# EAGLE design PCB_teensy (EAGLE 9.0.0)
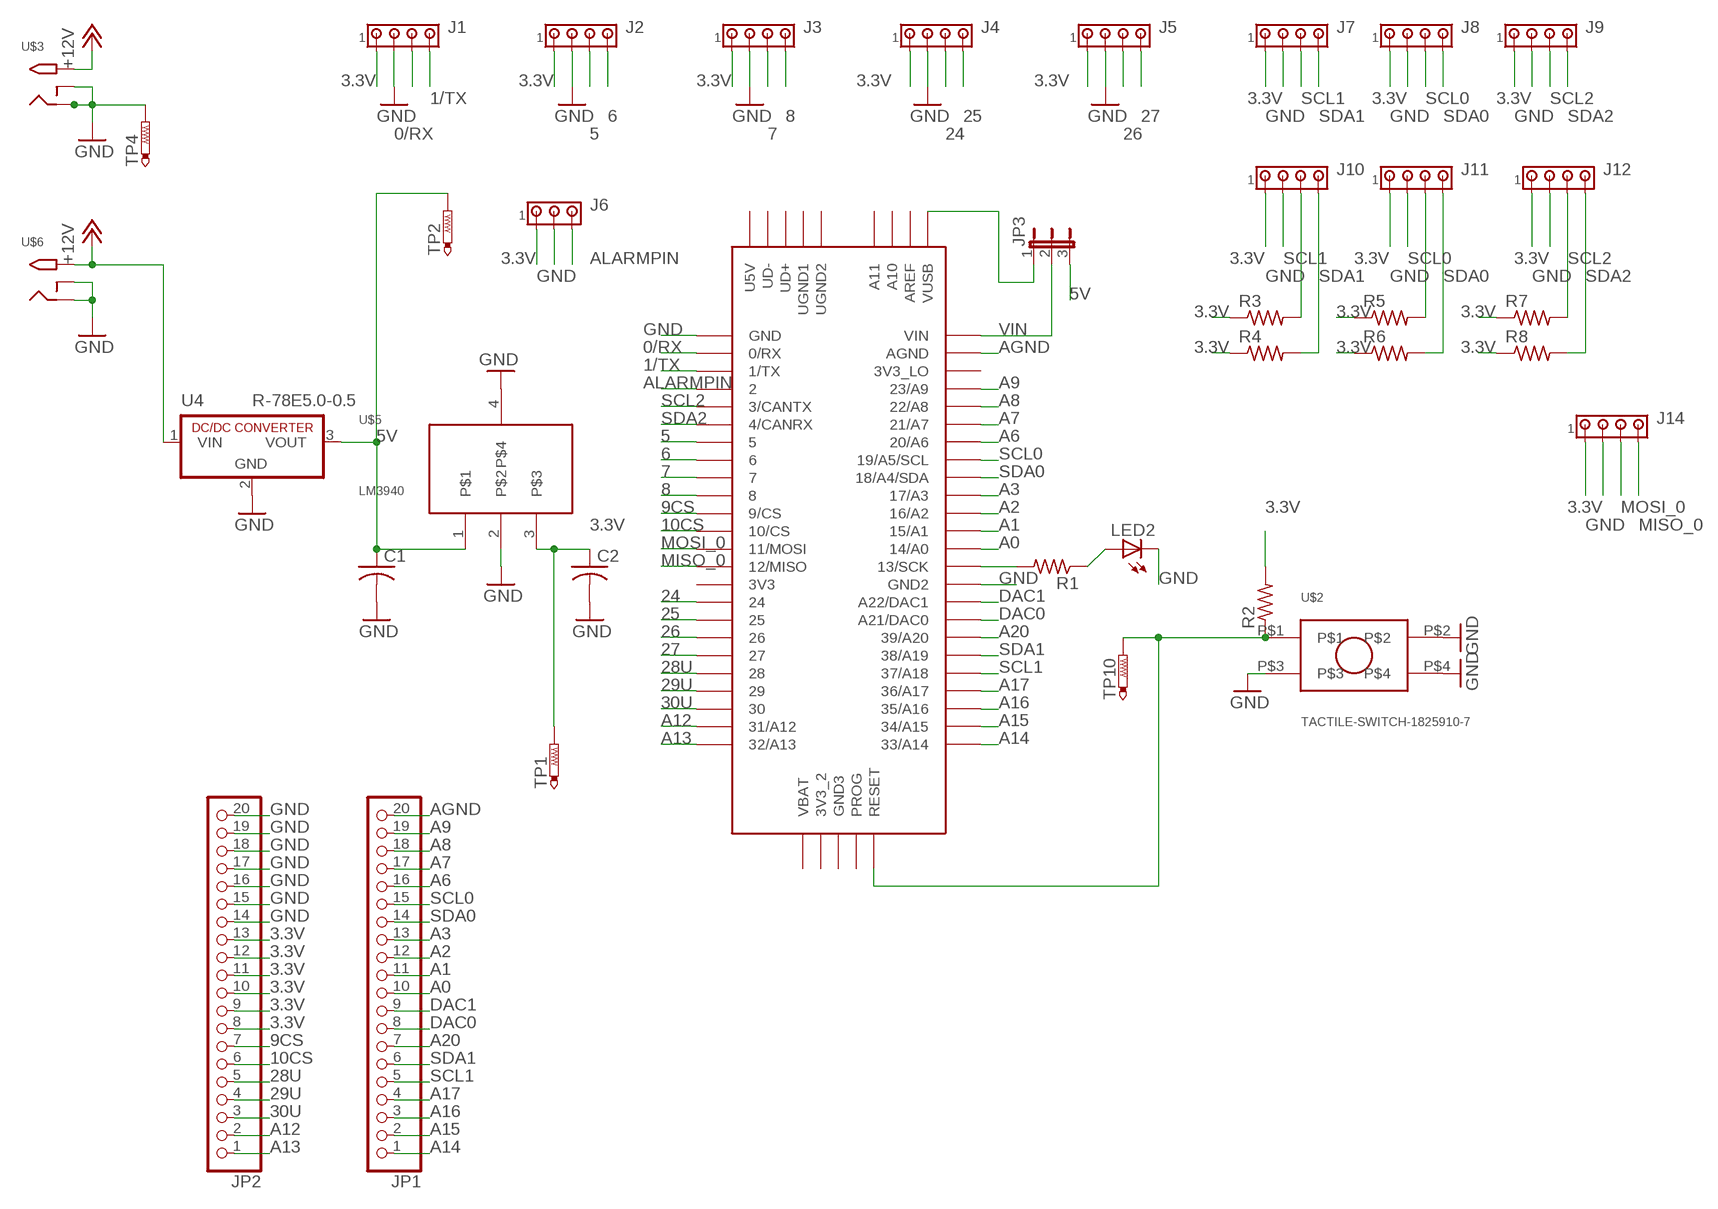
[diagram p0: schematic, sheet 1]

## Parts
C1  C-USC0805  [C0805]
C2  C-USC0805  [C0805]
J1  MTA04-100  [10X04MTA]
J2  MTA04-100  [10X04MTA]
J3  MTA04-100  [10X04MTA]
J4  MTA04-100  [10X04MTA]
J5  MTA04-100  [10X04MTA]
J6  MTA03-100  [10X03MTA]
J7  MTA04-100  [10X04MTA]
J8  MTA04-100  [10X04MTA]
J9  MTA04-100  [10X04MTA]
J10  MTA04-100  [10X04MTA]
J11  MTA04-100  [10X04MTA]
J12  MTA04-100  [10X04MTA]
J14  MTA04-100  [10X04MTA]
JP1  PINHD-1X20  [1X20]
JP2  PINHD-1X20  [1X20]
JP3  JP2W  [JP2W]
LED2  LEDCHIP-LED0805  [CHIP-LED0805]
R1  R-US_R0805  [R0805]
R2  R-US_R0805  [R0805]
R3  R-US_R0805  [R0805]
R4  R-US_R0805  [R0805]
R5  R-US_R0805  [R0805]
R6  R-US_R0805  [R0805]
R7  R-US_R0805  [R0805]
R8  R-US_R0805  [R0805]
TP1  PTR1B2,54  [B2,54]
TP2  PTR1B2,54  [B2,54]
TP4  PTR1B2,54  [B2,54]
TP10  PTR1B2,54  [B2,54]
U4  R-78E5.0-0.5  [SIP3]
U$1  TEENSY_3.5/3.6  [TEENSY_3.5/3.6]
U$2  TACTILE-SWITCH-1825910-7  [1825910-7]
U$3  2.1MMJACKTHM  [PJ-102A]
U$5  LM3940  [SOT223]
U$6  2.1MMJACKTHM  [PJ-102A]

## Nets
0/RX: J1.3 U$1.0/RX
1/TX: J1.4 U$1.1/TX
3.3V: C2.1 J1.1 J2.1 J3.1 J4.1 J5.1 J6.1 J7.1 J8.1 J9.1 J10.1 J11.1 J12.1 J14.1 JP2.8 JP2.9 JP2.10 JP2.11 JP2.12 JP2.13 R2.2 R3.1 R4.1 R5.1 R6.1 R7.1 R8.1 TP1.TP U$5.3
5: J2.3 U$1.5
5V: C1.1 JP3.3 TP2.TP U4.3(VOUT) U$5.1
6: J2.4 U$1.6
7: J3.3 U$1.7
8: J3.4 U$1.8
9CS: JP2.7 U$1.9/CS
10CS: JP2.6 U$1.10/CS
24: J4.3 U$1.24
25: J4.4 U$1.25
26: J5.3 U$1.26
27: J5.4 U$1.27
28U: JP2.5 U$1.28
29U: JP2.4 U$1.29
30U: JP2.3 U$1.30
+12V: U4.1(VIN) U$3.TIP U$6.TIP
A0: JP1.10 U$1.14/A0
A1: JP1.11 U$1.15/A1
A2: JP1.12 U$1.16/A2
A3: JP1.13 U$1.17/A3
A6: JP1.16 U$1.20/A6
A7: JP1.17 U$1.21/A7
A8: JP1.18 U$1.22/A8
A9: JP1.19 U$1.23/A9
A12: JP2.2 U$1.31/A12
A13: JP2.1 U$1.32/A13
A14: JP1.1 U$1.33/A14
A15: JP1.2 U$1.34/A15
A16: JP1.3 U$1.35/A16
A17: JP1.4 U$1.36/A17
A20: JP1.7 U$1.39/A20
AGND: JP1.20 U$1.AGND
ALARMPIN: J6.3 U$1.2
DAC0: JP1.8 U$1.21/DAC0(A21/DAC0)
DAC1: JP1.9 U$1.A22/DAC1
GND: C1.2 C2.2 J1.2 J2.2 J3.2 J4.2 J5.2 J6.2 J7.2 J8.2 J9.2 J10.2 J11.2 J12.2 J14.2 JP2.14 JP2.15 JP2.16 JP2.17 JP2.18 JP2.19 JP2.20 LED2.C TP4.TP U4.2(GND) U$1.GND U$1.GND2 U$2.P$2 U$2.P$3 U$2.P$4 U$3.RING U$3.RING_SW U$5.2 U$5.4 U$6.RING U$6.RING_SW
MISO_0: J14.4 U$1.12/MISO
MOSI_0: J14.3 U$1.11/MOSI
N$2: JP3.1 U$1.VUSB
N$4: R2.1 TP10.TP U$1.RESET U$2.P$1
N$17: R1.2 U$1.13/SCK
N$18: LED2.A R1.1
SCL0: J8.3 J11.3 JP1.15 R5.2 U$1.19/A5/SCL
SCL1: J7.3 J10.3 JP1.5 R3.2 U$1.37/A18
SCL2: J9.3 J12.3 R7.2 U$1.3/CANTX
SDA0: J8.4 J11.4 JP1.14 R6.2 U$1.18/A4/SDA
SDA1: J7.4 J10.4 JP1.6 R4.2 U$1.38/A19
SDA2: J9.4 J12.4 R8.2 U$1.4/CANRX
VIN: JP3.2 U$1.VIN
Unconnected: U$1.3V3 U$1.3V3_2 U$1.3V3_LO U$1.A10 U$1.A11 U$1.AREF U$1.GND3 U$1.PROG U$1.U5V U$1.UD+ U$1.UD- U$1.UGND1 U$1.UGND2 U$1.VBAT

## Library data of the parts
C1 C2 = adafruit:C-US: CAPACITOR, American symbol
J1-J5 J7-J12 J14 = con-amp:MTA04-100: AMP connector
J6 = con-amp:MTA03-100: AMP connector
JP1 JP2 = adafruit:PINHD-1X20: PIN HEADER
JP3 = jumper:JP2W: JUMPER
LED2 = led:LED: LED OSRAM: - CHIPLED LG R971, LG N971, LY N971, LG Q971, LY Q971, LO R971, LY R971 LH N974, LH R974 LS Q976, LO Q976, LY Q976 LO Q996 - Hyper CHIPLED LW Q18S LB Q993, LB Q99A, LB R99A - SideLED LS A670, LO A670, LY A670, LG A670, LP A670 LB A673, LV A673, LT A673, LW A673 LH A674 LY A675 LS A676, LA A676, LO A676, LY A676, LW A676 LS A679, LY A679, LG A679 - Hyper Micro SIDELED® LS Y876, LA Y876, LO Y876, LY Y876 LT Y87S - SmartLED LW L88C, LW L88S LB L89C, LB L89S, LG L890 LS L89K, LO L89K, LY L89K LS L896, LA L896, LO L896, LY L896 - TOPLED LS T670, LO T670, LY T670, LG T670, LP T670 LSG T670, LSP T670, LSY T670, LOP T670, LYG T670 LG T671, LOG T671, LSG T671 LB T673, LV T673, LT T673, LW T673 LH T674 LS T676, LA T676, LO T676, LY T676, LB T676, LH T676, LSB T676, LW T676 LB T67C, LV T67C, LT T67C, LS T67K, LO T67K, LY T67K, LW E67C LS E67B, LA E67B, LO E67B, LY E67B, LB E67C, LV E67C, LT E67C LW T67C LS T679, LY T679, LG T679 LS T770, LO T770, LY T770, LG T770, LP T770 LB T773, LV T773, LT T773, LW T773 LH T774 LS E675, LA E675, LY E675, LS T675 LS T776, LA T776, LO T776, LY T776, LB T776 LHGB T686 LT T68C, LB T68C - Hyper Mini TOPLED® LB M676 - Mini TOPLED Santana® LG M470 LS M47K, LO M47K, LY M47K Source: http://www.osram.convergy.de LUXEON: - LUMILED® LXK2-PW12-R00, LXK2-PW12-S00, LXK2-PW14-U00, LXK2-PW14-V00 LXK2-PM12-R00, LXK2-PM12-S00, LXK2-PM14-U00 LXK2-PE12-Q00, LXK2-PE12-R00, LXK2-PE12-S00, LXK2-PE14-T00, LXK2-PE14-U00 LXK2-PB12-K00, LXK2-PB12-L00, LXK2-PB12-M00, LXK2-PB14-N00, LXK2-PB14-P00, LXK2-PB14-Q00 LXK2-PR12-L00, LXK2-PR12-M00, LXK2-PR14-Q00, LXK2-PR14-R00 LXK2-PD12-Q00, LXK2-PD12-R00, LXK2-PD12-S00 LXK2-PH12-R00, LXK2-PH12-S00 LXK2-PL12-P00, LXK2-PL12-Q00, LXK2-PL12-R00 Source: www.luxeon.com KINGBRIGHT: KA-3528ASYC Source: www.kingbright.com
R1-R8 = adafruit:R-US_: RESISTOR, American symbol
TP1 TP2 TP4 TP10 = testpad:PTR1: TEST PIN
U4 = WALL-E_Parts:R-78E5.0-0.5
U$1 = WALL-E_Parts:TEENSY_3.5/3.6
U$2 = WALL-E_Parts:TACTILE-SWITCH-1825910-7
U$3 U$6 = adafruit:2.1MMJACK: 2.1mm x 5.5mm THM DC jack with internal switch. Digikey part #PJ-102A, 4UCON part #05537 2.1mm x 5.5mm SMT DC jack with internal switch. Digikey part #PJ-002A-SMT, 4UCON part #03267 By microbuilder.eu & adafruit.com
U$5 = WALL-E_Parts:LM3940

## Board
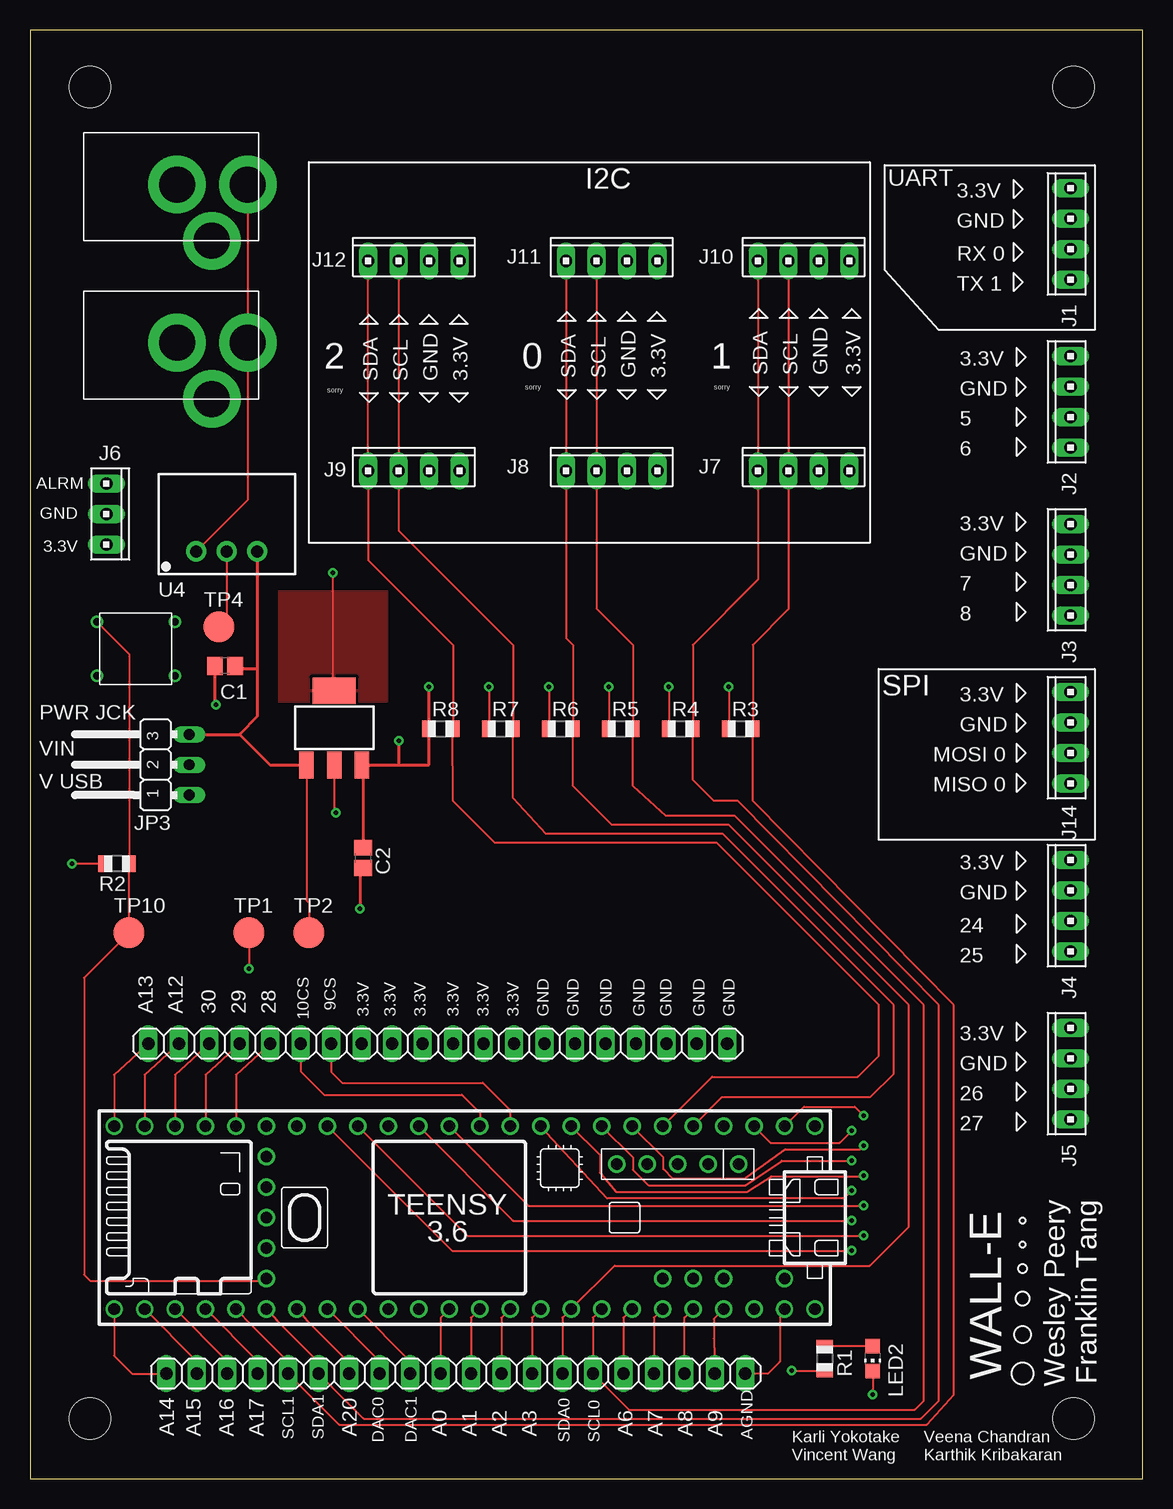
[diagram p1: board, top side]
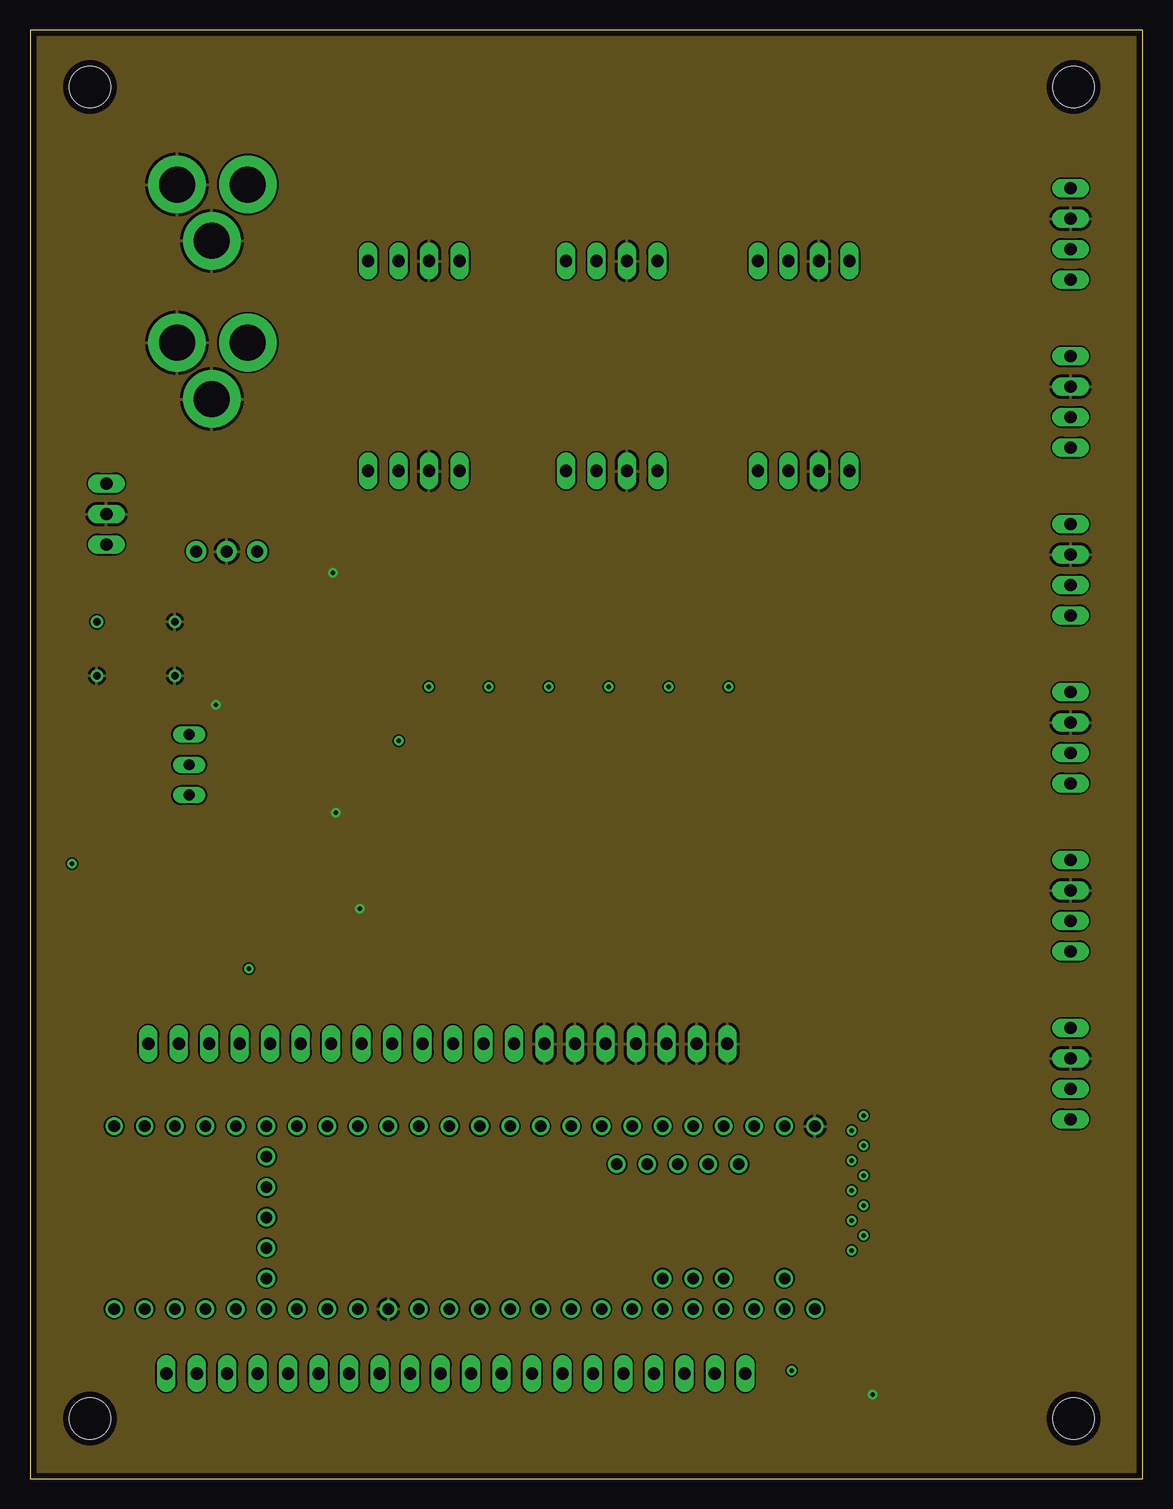
[diagram p2: board, inner layer Route2]
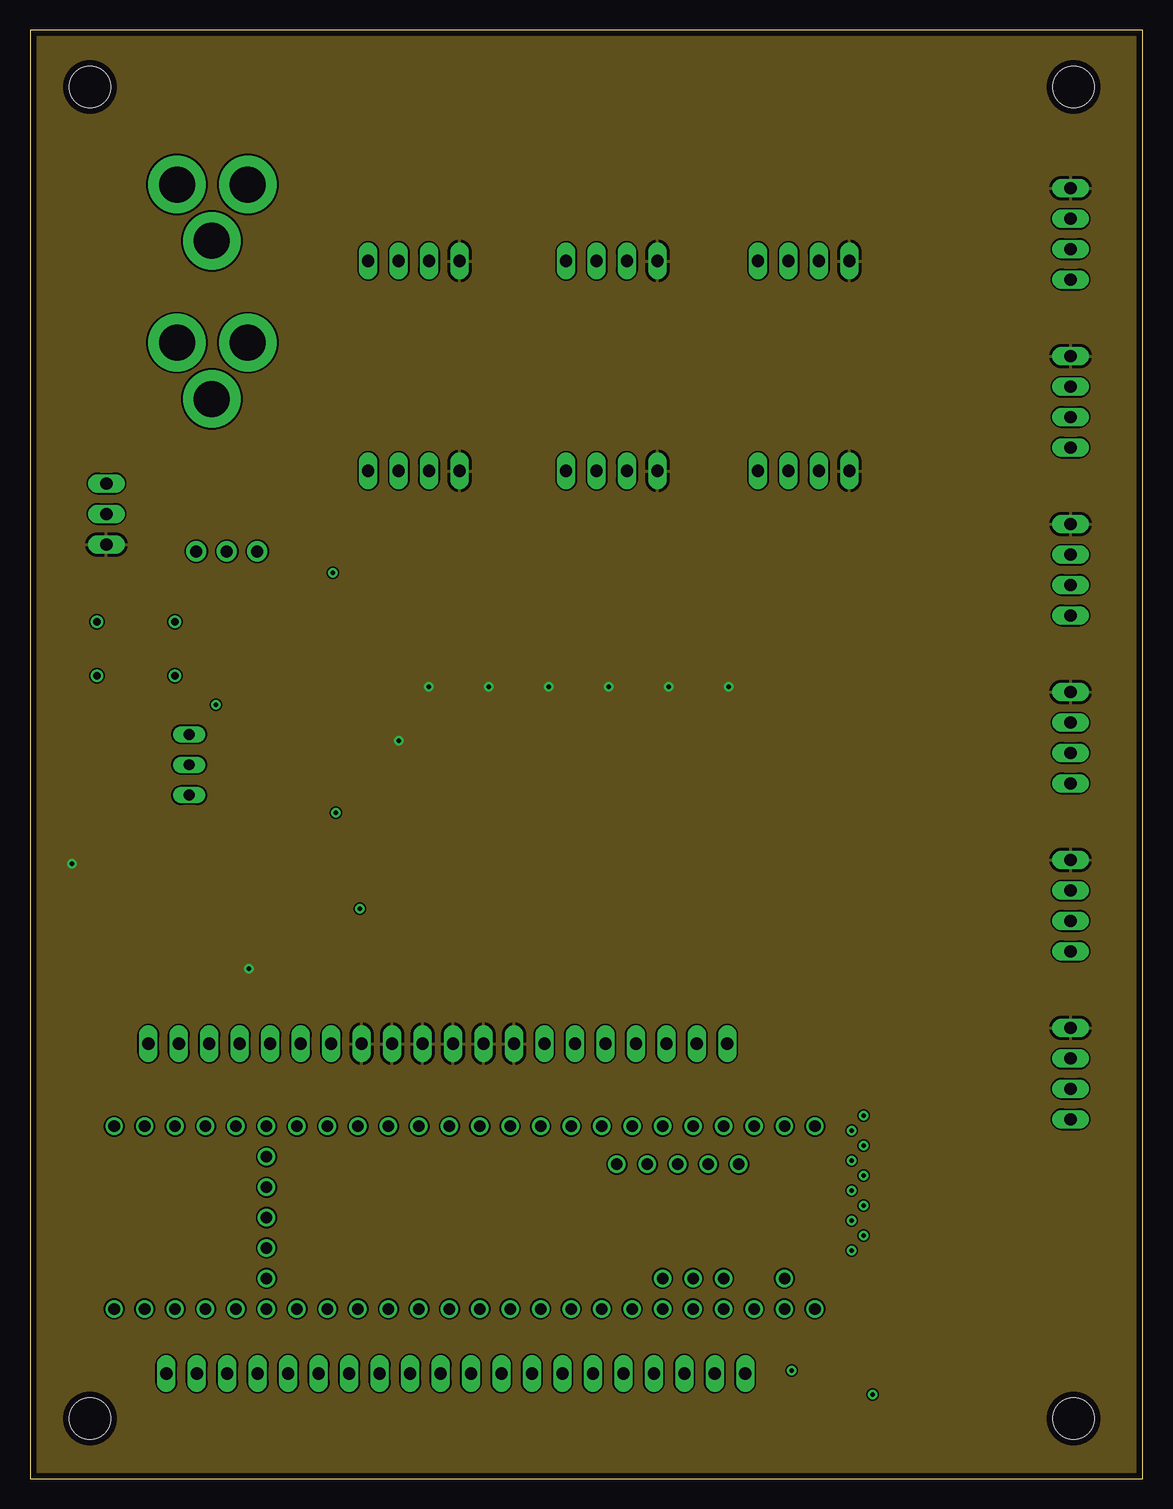
[diagram p3: board, inner layer Route15]
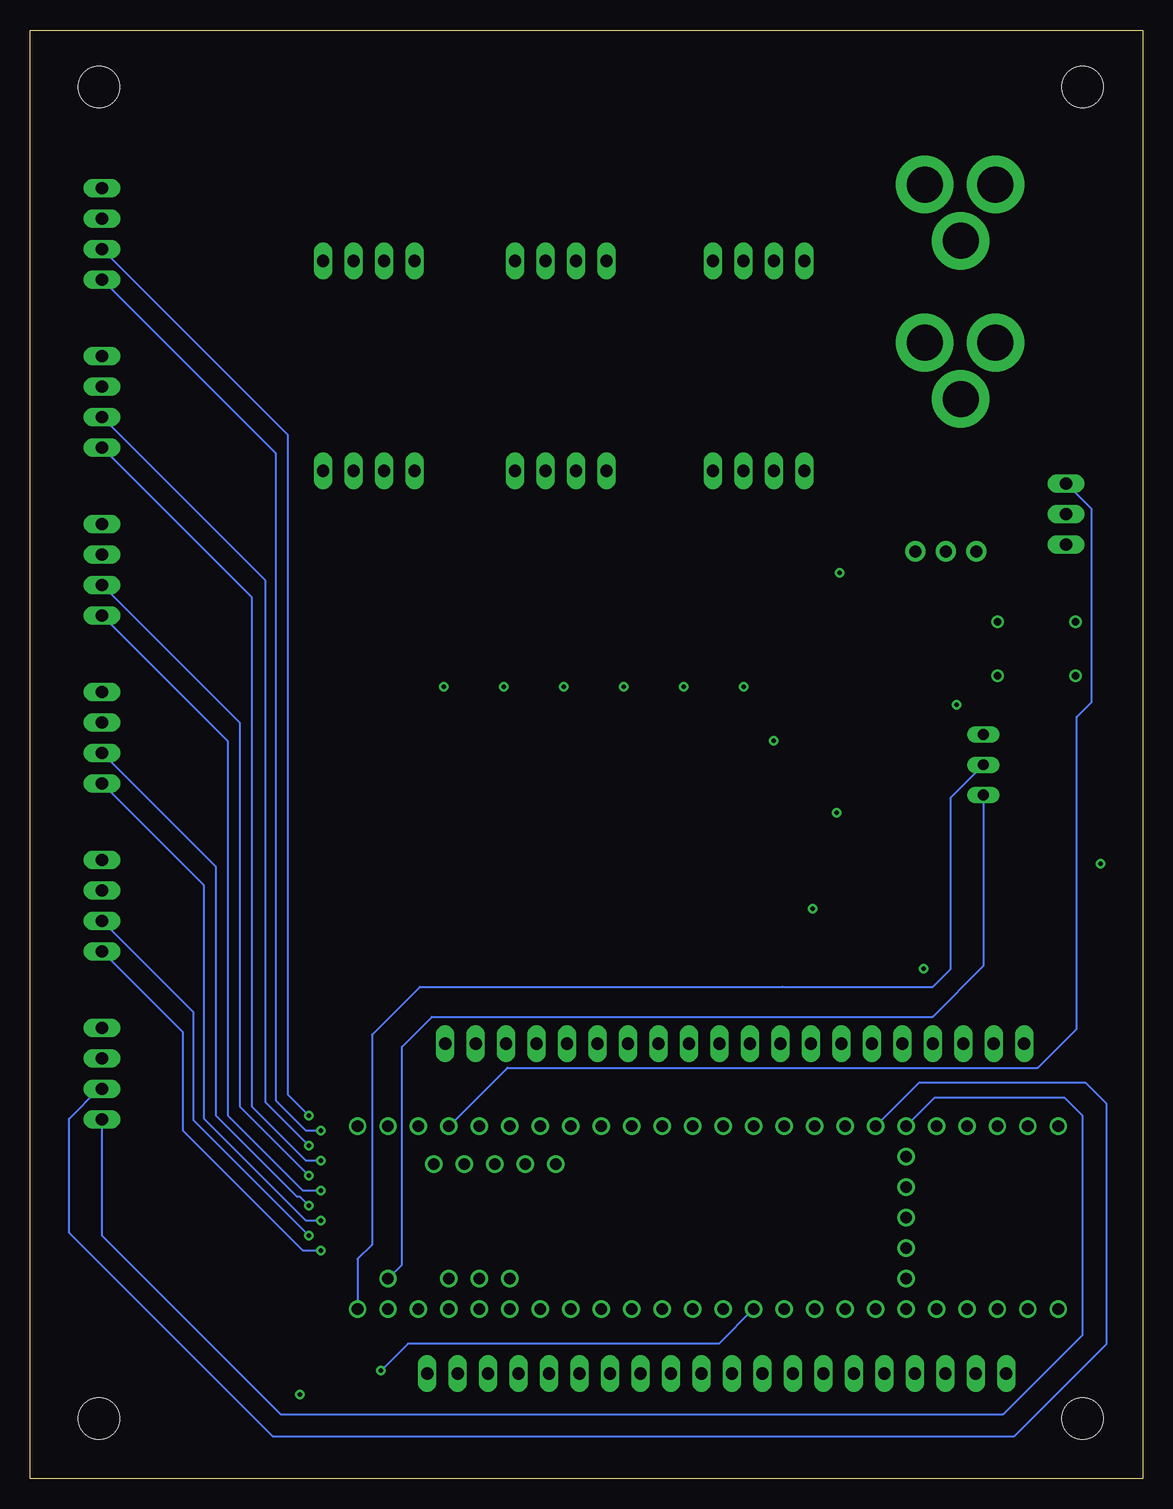
[diagram p4: board, bottom side, seen from below]

Size 92.75 x 120.75 mm. Coordinates in mm from the lower left corner, seen from the top.
Outline: 0,0 92.75,0 92.75,120.75 0,120.75 0,0
Copper layers (1+2*15+16): Top 0.0178mm / dielectric 12mil / Route2 0.0356mm / dielectric 28mil / Route15 0.0356mm / dielectric 12mil / Bottom 0.0178mm
Design rules "SSC-EAGLE-4Lyr_v1.0.0.3": minimum track width 6mil, minimum drill 8mil, track to track 6mil, track to pad 6mil, pad to pad 6mil, via to via 6mil, smd to smd 6mil, copper to edge 20mil, drill to drill 16mil, minimum pad ring 8mil, minimum via ring 8mil, stop-mask expansion 3mil, vias tented up to drill 0mil, thermal gap 10mil
Holes 3.45 mm at 5,5 87,5 5,116 87,116

### Footprints (pad centres in the part's own frame; a part is rotated, then mirrored left to right if it is on the bottom)
C0805 = smd 1.3 x 1.5: 1 -0.85,0; 2 0.85,0
10X04MTA = drill 1.016 long: 1 3.81,0; 2 1.27,0; 3 -1.27,0; 4 -3.81,0
10X03MTA = drill 1.016 long: 1 2.54,0; 2 0,0; 3 -2.54,0
1X20 = drill 1.016 long: 1 -24.13,0; 2 -21.59,0; 3 -19.05,0; 4 -16.51,0; 5 -13.97,0; 6 -11.43,0; 7 -8.89,0; 8 -6.35,0; 9 -3.81,0; 10 -1.27,0; 11 1.27,0; 12 3.81,0; 13 6.35,0; 14 8.89,0; 15 11.43,0; 16 13.97,0; 17 16.51,0; 18 19.05,0; 19 21.59,0; 20 24.13,0
JP2W = drill 0.914 long: 1 -2.54,-1.27; 2 0,-1.27; 3 2.54,-1.27
CHIP-LED0805 = smd 1.2 x 1.2: A 0,-1.05; C 0,1.05
R0805 = smd 1.1 x 1.4: 1 -1,0; 2 1,0
B2,54 = smd 2.54 x 2.54: TP 0,0
SIP3 = drill 1 pad 1.676: 1 -2.54,0; 2 0,0; 3 2.54,0
TEENSY_3.5/3.6 = drill 0.965: 0/RX -25.4,-7.62; 1/TX -22.86,-7.62; 2 -20.32,-7.62; 3/CANTX -17.78,-7.62; 3V3 7.62,-7.62; 3V3_2 17.78,-2.54; 3V3_LO -22.86,7.62; 4/CANRX -15.24,-7.62; 5 -12.7,-7.62; 6 -10.16,-7.62; 7 -7.62,-7.62; 8 -5.08,-7.62; 9/CS -2.54,-7.62; 10/CS 0,-7.62; 11/MOSI 2.54,-7.62; 12/MISO 5.08,-7.62; 13/SCK 5.08,7.62; 14/A0 2.54,7.62; 15/A1 0,7.62; 16/A2 -2.54,7.62; 17/A3 -5.08,7.62; 18/A4/SDA -7.62,7.62; 19/A5/SCL -10.16,7.62; 20/A6 -12.7,7.62; 21/A7 -15.24,7.62; 21/DAC0 12.7,7.62; 22/A8 -17.78,7.62; 23/A9 -20.32,7.62; 24 10.16,-7.62; 25 12.7,-7.62; 26 15.24,-7.62; 27 17.78,-7.62; 28 20.32,-7.62; 29 22.86,-7.62; 30 25.4,-7.62; 31/A12 27.94,-7.62; 32/A13 30.48,-7.62; 33/A14 30.48,7.62; 34/A15 27.94,7.62; 35/A16 25.4,7.62; 36/A17 22.86,7.62; 37/A18 20.32,7.62; 38/A19 17.78,7.62; 39/A20 15.24,7.62; A10 -17.78,5.08; A11 -15.24,5.08; A22/DAC1 10.16,7.62; AGND -25.4,7.62; AREF -20.32,5.08; GND -27.94,-7.62; GND2 7.62,7.62; GND3 17.78,0; PROG 17.78,2.54; RESET 17.78,5.08; U5V -21.59,-4.445; UD+ -16.51,-4.445; UD- -19.05,-4.445; UGND1 -13.97,-4.445; UGND2 -11.43,-4.445; VBAT 17.78,-5.08; VIN -27.94,7.62; VUSB -25.4,5.08
1825910-7 = drill 0.6 pad 1.016: P$1 -0.25,5.25; P$2 6.25,5.25; P$3 -0.25,0.75; P$4 6.25,0.75
PJ-102A = drill 3 pad 4.8: RING 0.1,-3.39; RING_SW -4.6,-6.29; TIP 0.1,-9.29
SOT223 = smd 1.219 x 2.235: 1 -2.311,-3.099; 2 0,-3.099; 3 2.311,-3.099 | smd 3.6 x 2.2: 4 0,3.099

### Placement (x,y rotation side)
C1  16.25,67.75 180 top
C2  27.75,51.75 270 top
J1  86.75,103.75 90 top
J2  86.75,89.75 90 top
J3  86.75,75.75 90 top
J4  86.75,47.75 90 top
J5  86.75,33.75 90 top
J6  6.37,80.4 270 top
J7  64.5,84 0 top
J8  48.5,84 0 top
J9  32,84 0 top
J10  64.5,101.5 0 top
J11  48.5,101.5 0 top
J12  32,101.5 0 top
J14  86.75,61.75 90 top
JP1  35.5,8.75 0 top
JP2  34,36.25 0 top
JP3  12,59.5 90 top
LED2  70.25,10 180 top
R1  66.25,10 270 top
R2  7.25,51.25 180 top
R3  59.25,62.5 0 top
R4  54.25,62.5 0 top
R5  49.25,62.5 0 top
R6  44.25,62.5 0 top
R7  39.25,62.5 0 top
R8  34.25,62.5 0 top
TP1  18.25,45.5 0 top
TP2  23.25,45.5 0 top
TP4  15.75,71 0 top
TP10  8.25,45.5 0 top
U4  16.41,77.29 0 top
U$1  37.5,21.75 180 top
U$2  5.83,66.17 0 top
U$3  8.87,94.59 90 top
U$5  25.36,62.58 0 top
U$6  8.87,107.77 90 top

### Tracks (layer width: path | path; a pad name or v marks a point on that pad's centre or on a via)
0/RX  (via drill 0.35)
  Top 0.152: U$1.0/RX 64.53,31 68.75,31 v69.5,30.25
  Bottom 0.152: v69.5,30.25 71.25,32 71.25,86.98 J1.3
1/TX  (via drill 0.35)
  Top 0.152: U$1.1/TX 61.73,28 67.5,28 v68.5,29
  Bottom 0.152: v68.5,29 69.75,29 72.25,31.5 72.25,85.44 J1.4
3.3V  (via drill 0.35)
  Top 0.152: 52.75,63 R4.1 v53.25,66 | v48.25,66 R5.1 | v43.25,66 R6.1 | v38.25,66 R7.1 | v58.25,66 R3.1 | TP1.TP v18.25,42.5 | R2.2 v3.5,51.25 | U$5.3 arc-90 27.75,59.4
  Top 0.254: v33.25,66 R8.1 33.25,59.48 30.75,59.48 | U$5.3 30.75,59.48 | 30.75,59.48 v30.75,61.5 | 27.75,59.4 C2.1
  pour Route15: 0,0 92.75,0 92.75,120.75 0,120.75
5  (via drill 0.35)
  Top 0.152: U$1.5 52.81,26.76 52.81,25.8 53.61,25 59.5,25 62.95,27.45 69.19,27.45 v69.5,27.75
  Bottom 0.152: v69.5,27.75 73.12,31.38 73.12,74.86 J2.3
5V
  Top 0.152: TP2.TP 23.1,45.65 23.25,45.8 23.25,48 23.05,48.2 U$5.1 23,59.48 23.1,59.38 | 17.35,67.5 C1.1
  Top 0.254: JP3.3 17.46,62.04 | 23,59.48 20.02,59.48 17.46,62.04 | U4.3 18.95,67.5 | 18.95,67.5 18.95,63.53 17.46,62.04 | 18.95,67.5 17.35,67.5
6  (via drill 0.35)
  Top 0.152: U$1.6 50.25,26.78 50.25,25.75 51.55,24.45 59.63,24.45 62.68,26.5 v68.5,26.5
  Bottom 0.152: v68.5,26.5 69.75,26.5 74.25,31 74.25,73.44 J2.4
7  (via drill 0.35)
  Top 0.152: U$1.7 47.5,26.99 47.5,25.5 48.86,23.89 59.75,23.89 61.81,25.19 69.44,25.19 v69.5,25.25
  Bottom 0.152: v69.5,25.25 75.25,31 75.25,62.98 J3.3
8  (via drill 0.35)
  Top 0.152: U$1.8 48.11,23.34 67.84,23.34 v68.5,24
  Bottom 0.152: v68.5,24 70,24 76.25,30.25 76.25,61.44 J3.4
9CS
  Top 0.152: JP2.7 25.11,33.89 26,33 37.75,33 40.04,30.71 U$1.9/CS
10CS
  Top 0.152: JP2.6 22.57,33.93 24.5,32 36,32 37.5,30.5 U$1.10/CS
24  (via drill 0.35)
  Top 0.152: U$1.24 36.46,20.25 v69.5,20.25
  Bottom 0.152: v69.5,20.25 79.12,29.88 79.12,38.85 J4.3
25  (via drill 0.35)
  Top 0.152: U$1.25 35.17,19 v68.5,19
  Bottom 0.152: v68.5,19 70,19 80,29 80,37.19 J4.4
26
  Bottom 0.152: J5.3 87.02,32.48 89.5,30 89.5,20.5 72.5,3.5 10.75,3.5 3,11.25 3,31.25 4.75,33 18.63,33 U$1.26
27
  Bottom 0.152: J5.4 86.75,20.25 71.88,5.38 11.62,5.38 5,12 5,30.25 6.5,31.75 17.34,31.75 U$1.27
28U
  Top 0.152: JP2.5 17.18,33.65 U$1.28
29U
  Top 0.152: JP2.4 14.64,33.65 U$1.29
30U
  Top 0.152: JP2.3 12.1,33.65 U$1.30
+12V
  Top 0.152: U$6.TIP U$3.TIP 18.16,81.58 U4.1
A0
  Top 0.152: U$1.14/A0 34.23,13.4 JP1.10
A1
  Top 0.152: U$1.15/A1 36.77,13.4 JP1.11
A2
  Top 0.152: U$1.16/A2 39.31,13.4 JP1.12
A3
  Top 0.152: U$1.17/A3 41.85,13.4 JP1.13
A6
  Top 0.152: U$1.20/A6 49.47,13.4 JP1.16
A7
  Top 0.152: U$1.21/A7 52.01,13.4 JP1.17
A8
  Top 0.152: JP1.18 54.55,13.4 U$1.22/A8
A9
  Top 0.152: U$1.23/A9 57,13.31 57,11.66 JP1.19
A12
  Top 0.152: JP2.2 9.56,33.65 U$1.31/A12
A13
  Top 0.152: JP2.1 7.02,33.65 U$1.32/A13
A14
  Top 0.152: U$1.33/A14 7.02,10.23 8.5,8.75 JP1.1
A15
  Top 0.152: U$1.34/A15 13.91,9.78 JP1.2
A16
  Top 0.152: U$1.35/A16 16.45,9.78 JP1.3
A17
  Top 0.152: U$1.36/A17 18.99,9.78 JP1.4
A20
  Top 0.152: U$1.39/A20 23.12,13.13 26.61,9.64 JP1.7
AGND
  Top 0.152: U$1.AGND 62.5,13.73 62.5,9.75 61.5,8.75 JP1.20
ALARMPIN
  Bottom 0.152: U$1.2 52.94,34.25 8.75,34.25 5.5,37.5 5.5,63.5 4.25,64.75 4.25,80.82 J6.3
DAC0
  Top 0.152: U$1.21/DAC0 29.15,9.78 JP1.8
DAC1
  Top 0.152: U$1.A22/DAC1 31.69,9.78 JP1.9
GND  (via drill 0.35)
  Top 0.152: U$5.4 arc-90 25.25,65.79 v25.25,75.5 | LED2.C v70.25,7 | U$5.2 25.36,55.64 v25.5,55.5 | C2.2 arc90 27.5,50.65 | 15.4,64.6 v15.5,64.5 | U4.2 16.41,71.66 TP4.TP
  Top 0.254: 27.5,50.65 v27.5,47.5 | C1.2 15.4,64.6
  pour Route2: 0,0 0,120.75 92.75,120.75 92.75,0
  pour Top: 20.75,64.75 20.75,74 21,74 29.75,74 29.75,72.5 29.75,64.75 29.5,64.75
MISO_0  (via drill 0.35)
  Top 0.152: U$1.12/MISO 40.29,21.5 v68.5,21.5
  Bottom 0.152: v68.5,21.5 69.75,21.5 78.25,30 78.25,49.44 J14.4
MOSI_0  (via drill 0.35)
  Top 0.152: U$1.11/MOSI 41.58,22.75 v69.5,22.75
  Bottom 0.152: J14.3 77.25,50.98 77.25,30.25 70.5,23.5 70.25,23.5 v69.5,22.75
N$2
  Bottom 0.152: U$1.VUSB 61.75,17.82 61.75,36 59.25,38.5 17.5,38.5 13.27,42.73 JP3.1
N$4
  Top 0.152: U$1.RESET 19.55,16.5 5,16.5 4.5,17 4.5,41.75 TP10.TP R2.1 8.25,68.75 U$2.P$1
N$17  (via drill 0.35)
  Top 0.152: v63.5,9 R1.2
  Bottom 0.152: v63.5,9 61.25,11.25 35.3,11.25 U$1.13/SCK
N$18
  Top 0.152: R1.1 66.3,11.05 LED2.A
SCL0
  Top 0.152: U$1.19/A5/SCL 46.93,13.4 JP1.15 49.93,5.75 73.75,5.75 74.5,6.5 74.5,39.5 58.75,55.25 53,55.25 50.25,57.75 R5.2 50.25,69.5 47.23,72.52 J8.3 J11.3
SCL1
  Top 0.152: U$1.37/A18 18.12,13.13 21.53,9.72 JP1.5 25.78,4.5 74.75,4.5 77,7 77,39.5 60.25,56.5 R3.2 60.25,69.5 63.23,72.48 J7.3 J10.3
SCL2
  Top 0.152: U$1.3/CANTX 57.7,31.8 70.05,31.8 72,33.75 72,39.5 57.75,53.75 43,53.75 40.25,56.75 R7.2 40.25,69.5 30.73,79.02 J9.3 J12.3
SDA0
  Top 0.152: JP1.14 44.39,13.4 U$1.18/A4/SDA 48.74,17.75 70,17.75 73.25,21 73.25,39.5 58.25,54.5 48.5,54.5 45.25,57.75 R6.2 45.25,69.5 44.69,70.06 J8.4 J11.4
SDA1
  Top 0.152: U$1.38/A19 20.62,13.13 24.07,9.68 JP1.6 27.82,5 74.25,5 75.75,6.5 75.75,39.5 59,56.5 57,56.5 55.25,58.25 R4.2 55.25,69.5 60.69,74.94 J7.4 J10.4
SDA2
  Top 0.152: U$1.4/CANRX 56.87,33.5 69,33.5 70.75,35.25 70.75,39.5 57.25,53 38.75,53 35.25,56.5 35.21,62.3 | 35.21,62.3 R8.2 | 35.21,62.3 35.25,62.34 35.25,69.5 28.19,76.56 J9.4 J12.4
VIN
  Bottom 0.152: U$1.VIN 65.44,18.31 64.25,19.5 64.25,37 60.25,41 30,41 17.5,41 16,42.5 16,56.77 JP3.2

### Text on the board
tPlace: I2C | UART | 3.3V | GND | RX 0 | TX 1 | 3.3V | 2 | SDA | SCL | GND | 3.3V | 0 | SDA | SCL | GND | 3.3V | 1 | SDA | SCL | GND | 3.3V | sorry | sorry | sorry | GND | 5 | 6 | ALRM | GND | 3.3V | 3.3V | GND | 7 | 8 | SPI | 3.3V | PWR JCK | GND | VIN | MOSI 0 | V USB | MISO 0 | 3.3V | GND | 24 | 25 | A13 | A12 | 30 | 29 | 28 | 9CS | 10CS | 3.3V | 3.3V | 3.3V | 3.3V | 3.3V | 3.3V | GND | GND | GND | GND | GND | GND | GND | 3.3V | GND | 26 | 27 | Wesley Peery / Franklin Tang | WALL-E | A14 | A15 | A16 | A17 | A20 | A0 | A1 | A2 | A3 | A6 | A7 | A8 | A9 | SCL1 | SDA1 | DAC0 | DAC1 | SDA0 | SCL0 | AGND | Karli Yokotake | Veena Chandran | Vincent Wang | Karthik Kribakaran